# EAGLE design geiger_01 (EAGLE 7.2.0)
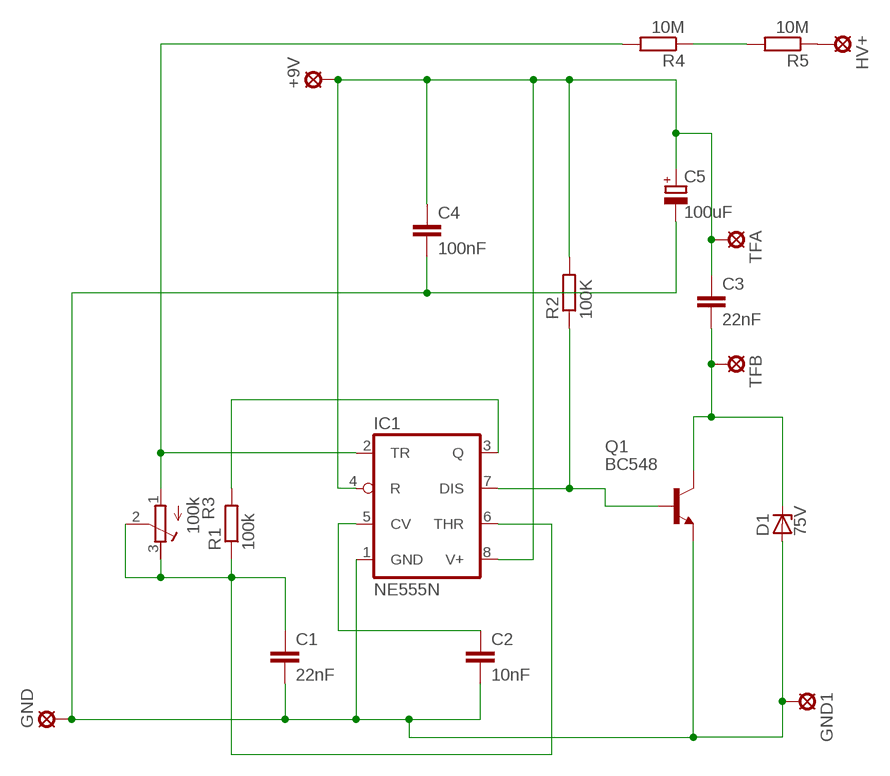
[diagram p0: schematic, sheet 1]

## Parts
+9V  LSP10  [LSP10]
C1  22nF  C-EU050-024X044  [C050-024X044]
C2  10nF  C-EU050-024X044  [C050-024X044]
C3  22nF  C-EU050-024X044  [C050-024X044]
C4  100nF  C-EU050-024X044  [C050-024X044]
C5  100uF  CPOL-EUE2.5-7  [E2,5-7]
D1  75V  ZENER-DIODEP1-Z12  [P1Z12]
GND  LSP10  [LSP10]
GND1  LSP10  [LSP10]
HV+  LSP10  [LSP10]
IC1  NE555N  [DIL08]
Q1  BC548  [TO92-EBC]
R1  100k  R-EU_0207/12  [0207/12]
R2  100K  R-EU_0207/12  [0207/12]
R3  100k  R-TRIMM3339P  [RTRIM3339P]
R4  10M  R-EU_0207/12  [0207/12]
R5  10M  R-EU_0207/12  [0207/12]
TFA  LSP10  [LSP10]
TFB  LSP10  [LSP10]

## Nets
N$1: +9V.MP C3.1 C4.1 C5.+ IC1.4(R) IC1.8(V+) R2.2 TFA.MP
N$3: C1.1 IC1.6(THR) R1.1 R3.2(S) R3.3(E)
N$5: C2.1 IC1.5(CV)
N$6: IC1.7(DIS) Q1.B R2.1
N$10: IC1.3(Q) R1.2
N$11: IC1.2(TR) R3.1(A) R4.2
N$12: C1.2 C2.2 C4.2 C5.- D1.A GND1.MP GND.MP IC1.1(GND) Q1.E
N$13: R4.1 R5.2
N$15: HV+.MP R5.1
TFB: C3.2 D1.C Q1.C TFB.MP

## Library data of the parts
+9V GND GND1 HV+ TFA TFB = solpad:LSP10: SOLDER PAD drill 1.0 mm, distributor Buerklin, 12H555
C1-C4 = rcl:C-EU: CAPACITOR, European symbol
C5 = rcl:CPOL-EU: POLARIZED CAPACITOR, European symbol
D1 = diode:ZENER-DIODE: Z-Diode
IC1 = linear:*555: TIMER
Q1 = transistor-npn:BC548*: NPN Transistor
R1 R2 R4 R5 = rcl:R-EU_: RESISTOR, European symbol
R3 = rcl:R-TRIMM: Trimm resistor

## Board
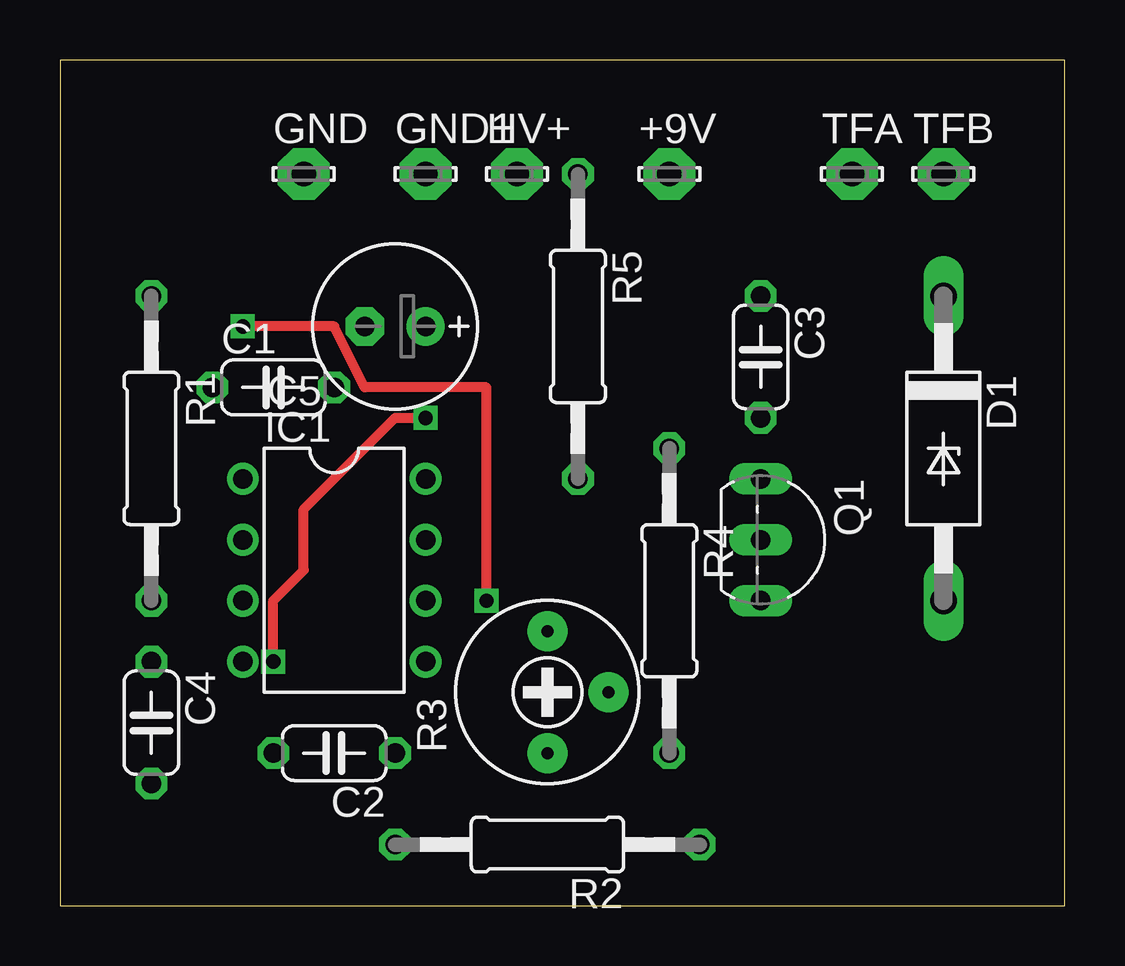
[diagram p1: board, top side]
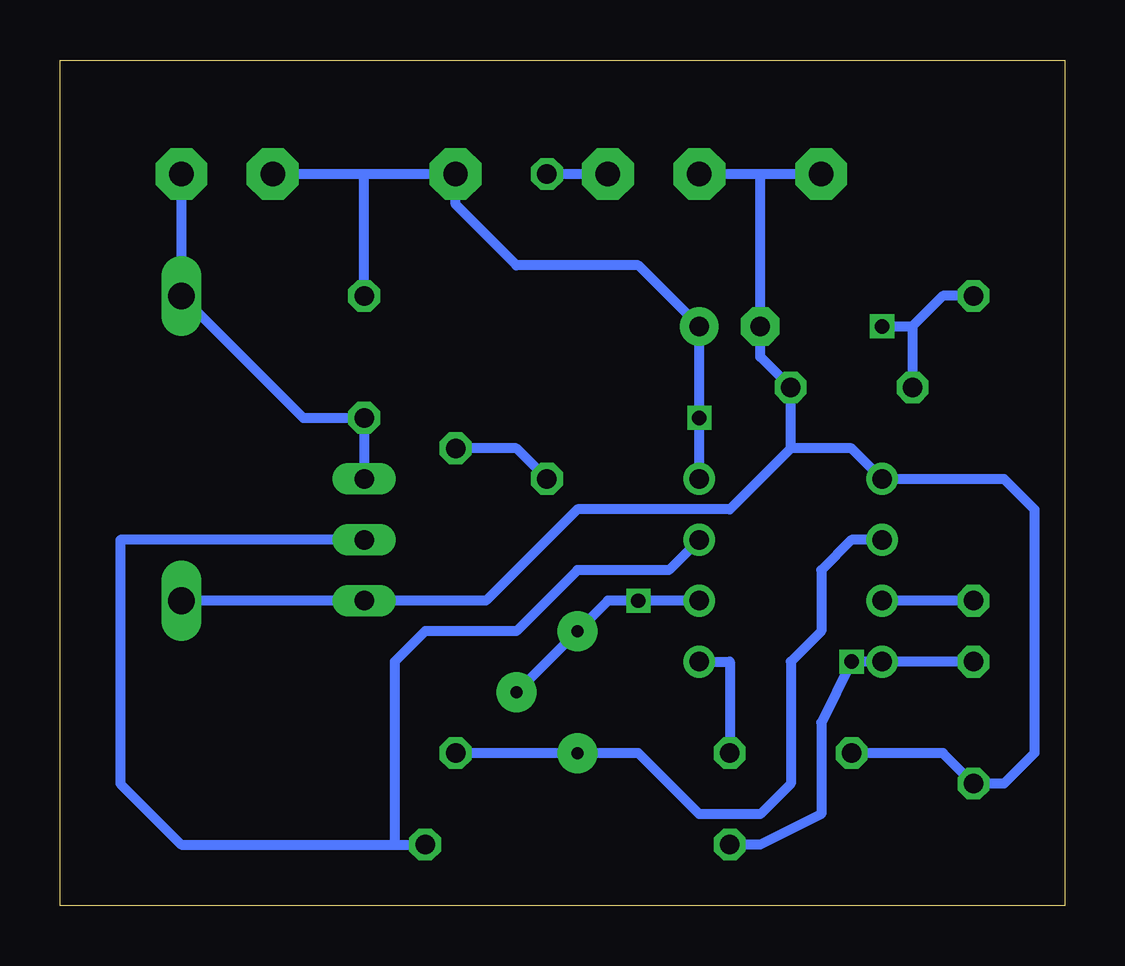
[diagram p2: board, bottom side, seen from below]

Size 41.89 x 35.23 mm. Coordinates in mm from the lower left corner, seen from the top.
Outline: 0,0 41.89,0 41.89,35.23 0,35.23 0,0
Copper layers (1*16): Top 0.035mm / dielectric 1.5mm / Bottom 0.035mm
Design rules "default": minimum track width 10mil, minimum drill 24mil, track to track 8mil, track to pad 8mil, pad to pad 8mil, via to via 8mil, smd to smd 8mil, copper to edge 40mil, drill to drill 8mil, minimum pad ring 10mil, minimum via ring 8mil, stop-mask expansion 4mil, vias tented up to drill 0mil, thermal gap 10mil

### Footprints (pad centres in the part's own frame; a part is rotated, then mirrored left to right if it is on the bottom)
LSP10 = drill 1.016 pad 2.159 octagon: MP 0,0
C050-024X044 = drill 0.813 octagon: 1 -2.54,0; 2 2.54,0
E2,5-7 = drill 0.813 pad 1.6: + -1.27,0 | drill 0.813 pad 1.6 octagon: - 1.27,0
P1Z12 = drill 1.118 long: A 6.35,0; C -6.35,0
DIL08 = drill 0.813 pad 1.27: 1 -3.81,-3.81; 2 -1.27,-3.81; 3 1.27,-3.81; 4 3.81,-3.81; 5 3.81,3.81; 6 1.27,3.81; 7 -1.27,3.81; 8 -3.81,3.81
TO92-EBC = drill 0.813 long: B 0,-1.27; C -2.54,-1.27; E 2.54,-1.27
0207/12 = drill 0.813 octagon: 1 -6.35,0; 2 6.35,0
RTRIM3339P = drill 0.5 pad 1.676: 1 -2.54,0; 2 0,-2.54; 3 2.54,0

### Placement (x,y rotation side)
+9V  25.4,30.48 0 top
C1  8.89,21.59 0 top
C2  11.43,6.35 180 top
C3  29.21,22.86 270 top
C4  3.81,7.62 270 top
C5  13.97,24.13 180 top
D1  36.83,19.05 270 top
GND  10.16,30.48 0 top
GND1  15.24,30.48 0 top
HV+  19.05,30.48 0 top
IC1  11.43,13.97 270 top
Q1  30.48,15.24 270 top
R1  3.81,19.05 270 top
R2  20.32,2.54 180 top
R3  20.32,8.89 90 top
R4  25.4,12.7 270 top
R5  21.59,24.13 270 top
TFA  33.02,30.48 0 top
TFB  36.83,30.48 0 top

### Tracks (layer width: path | path; a pad name or v marks a point on that pad's centre or on a via)
N$1  (via drill 0.6)
  Top 0.406: v8.89,10.16 8.89,12.7 10.16,13.97 10.16,16.51 13.97,20.32 v15.24,20.32
  Bottom 0.406: C4.1 IC1.4 v8.89,10.16 10.16,7.62 10.16,3.81 12.7,2.54 R2.2 | 29.21,30.48 +9V.MP 25.4,29.21 22.86,26.67 17.78,26.67 C5.+ v15.24,20.32 IC1.8 | 29.21,30.48 TFA.MP | C3.1 29.21,30.48
N$3  (via drill 0.6)
  Top 0.406: v17.78,12.7 17.78,21.59 12.7,21.59 11.43,24.13 v7.62,24.13
  Bottom 0.406: R1.1 5.08,25.4 6.35,24.13 | 6.35,24.13 C1.1 | R3.2 R3.3 19.05,12.7 v17.78,12.7 IC1.6 | v7.62,24.13 6.35,24.13
N$5
  Bottom 0.406: IC1.5 13.97,10.16 C2.1
N$6
  Bottom 0.406: Q1.B 39.37,15.24 39.37,5.08 36.83,2.54 27.94,2.54 | 27.94,2.54 R2.1 | IC1.7 16.51,13.97 20.32,13.97 22.86,11.43 26.67,11.43 27.94,10.16 27.94,2.54
N$10
  Bottom 0.406: R1.2 IC1.3
N$11
  Bottom 0.406: R4.2 R3.1 17.78,6.35 15.24,3.81 12.7,3.81 11.43,5.08 11.43,10.16 10.16,11.43 10.16,13.97 8.89,15.24 IC1.2
N$12
  Bottom 0.406: C2.2 5.08,6.35 C4.2 2.54,5.08 1.27,6.35 1.27,16.51 2.54,17.78 IC1.1 8.89,19.05 11.43,19.05 | 11.43,19.05 C1.2 12.7,22.86 C5.- 12.7,30.48 | GND.MP 12.7,30.48 | 12.7,30.48 GND1.MP | D1.A Q1.E 24.13,12.7 20.32,16.51 13.97,16.51 11.43,19.05
N$13
  Bottom 0.406: R5.2 22.86,19.05 R4.1
N$15
  Bottom 0.406: HV+.MP R5.1
TFB
  Bottom 0.406: TFB.MP D1.C 31.75,20.32 C3.2 Q1.C